# Altium schematic sheet [05] - Power supply.SchDoc: DWM1003
size A4; DocumentNumber: 5; Revision: v2; SheetNumber: 5; SheetTotal: 7; SheetFunction: Power supply
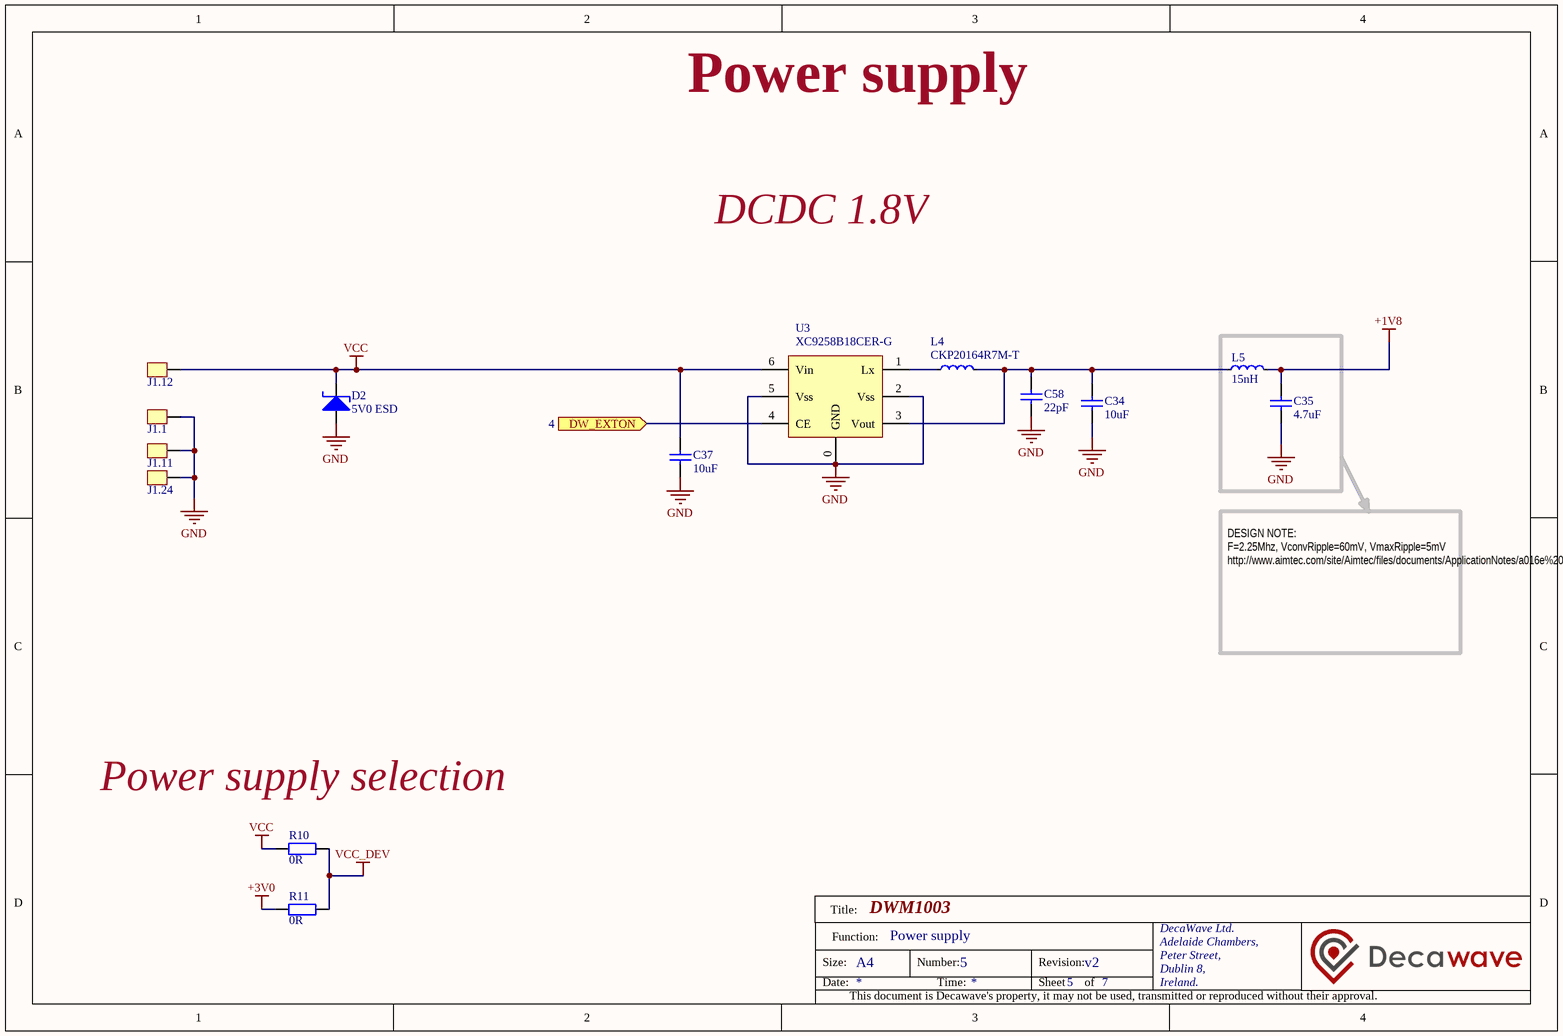
[diagram p0: [05] - Power supply.SchDoc]

## Parts
C34  10uF  [C0603]
C35  4.7uF  [C0603]
C37  10uF  [C0603]
C58  22pF  [C0201]
D2  5V0 ESD  [DFN65P100X40-2N]
J1.1  EDGE_PIN  [PCB_EDGE_1MM]  (value not drawn)  (no BOM)
J1.11  EDGE_PIN  [PCB_EDGE_1MM]  (value not drawn)  (no BOM)
J1.12  EDGE_PIN  [PCB_EDGE_1MM]  (value not drawn)  (no BOM)
J1.24  EDGE_PIN  [PCB_EDGE_1MM]  (value not drawn)  (no BOM)
L4  CKP20164R7M-T  [INDC2016X10N]
L5  15nH  [INDC1005X05N]
R10  0R  [R0201]
R11  0R  [R0201]
U3  XC9258B18CER-G  [USP-6C]

## Ports
DW_EXTON (in, see 4)

## Nets
+1V8: C35.2 L5.2
+3V0: R11.1
GND: C34.1 C35.1 C37.1 C58.1 D2.A J1.1.0 J1.11.0 J1.24.0 U3.0(GND) U3.2(Vss) U3.5(Vss)
VCC: C37.2 D2.K J1.12.0 R10.1 U3.6(Vin)
VCC_DEV: R10.2 R11.2
DW_EXTON: U3.4(CE) ; port DW_EXTON
NetC34_2: C34.2 C58.2 L4.2 L5.1 U3.3(Vout)
NetL4_1: L4.1 U3.1(Lx)

## Notes on the sheet
- Power supply
- DCDC 1.8V
- DESIGN NOTE:
  F=2.25Mhz, VconvRipple=60mV, VmaxRipple=5mV
  http://www.aimtec.com/site/Aimtec/files/documents/ApplicationNotes/a016e%20-%20reduction%20of%20output%20ripple%20&%20noise.pdf
- (near R10) Power supply selection
- Title:
- Size:
- Date:
- Function:
- A4
- Number:
- Time:
- Revision:
- Sheet
- of
- DecaWave Ltd.
- Adelaide Chambers,
- Peter Street,
- Dublin 8,
- Ireland.
- This document is Decawave's property, it may not be used, transmitted or reproduced without their approval.

## Library data of the parts
C34 = GRM188R60J106ME84D: CAP CER 10UF 6.3V X5R 0603; Manufacturer: Murata Electronics North America; Manufacturer Part Number: GRM188R60J106ME47D
C35 = CL10A475KQ8NNN#: CAP CER 4.7UF 6.3V X5R 0603; Manufacturer: SamSung; Manufacturer Part Number: CL10A475KQ8NNN#
C37 = CL10A475KQ8NNN#: CAP CER 10UF 6.3V X5R 0603; Manufacturer: Murata Electronics North America; Manufacturer Part Number: GRM188R60J106ME47D
C58 = GRM0335C1E100JA01D: CAP CER 22PF 25V NP0 0201; Manufacturer: Murata Electronics North America; Manufacturer Part Number: GRM0335C1E220JA01D; Failure Rate: *
D2 = DF2S6.2CT,L3F: TVS DIODE 5VWM; Manufacturer: Toshiba Semiconductor and Storage; Manufacturer Part Number: DF2S6.2CT,L3F
J1.1 J1.11 J1.12 J1.24 = EDGE_PIN: PCB Edge pin
L4 = CKP20162R2M-T: FIXED IND 2.2UH 1.2A 110 MOHM; Manufacturer: TAIYO YUDEN; Manufacturer Part Number: CKP20162R2M-T
L5 = HK100515NJ-T: FIXED IND 15NH 320MA 460 MOHM; Manufacturer: Taiyo Yuden; Manufacturer Part Number: HK100515NJ-T
R10 R11 = RC0201JR-070RL: RES SMD 0.0OHM JUMPER 1/20W 0201; Manufacturer: Yageo; Manufacturer Part Number: RC0201JR-070RL
U3 = XC9257/8: Manufacturer: Torex; Manufacturer Part Number: XC9258B18CER-G